# Altium schematic sheet 02-CPU_BOARD.SchDoc
size B
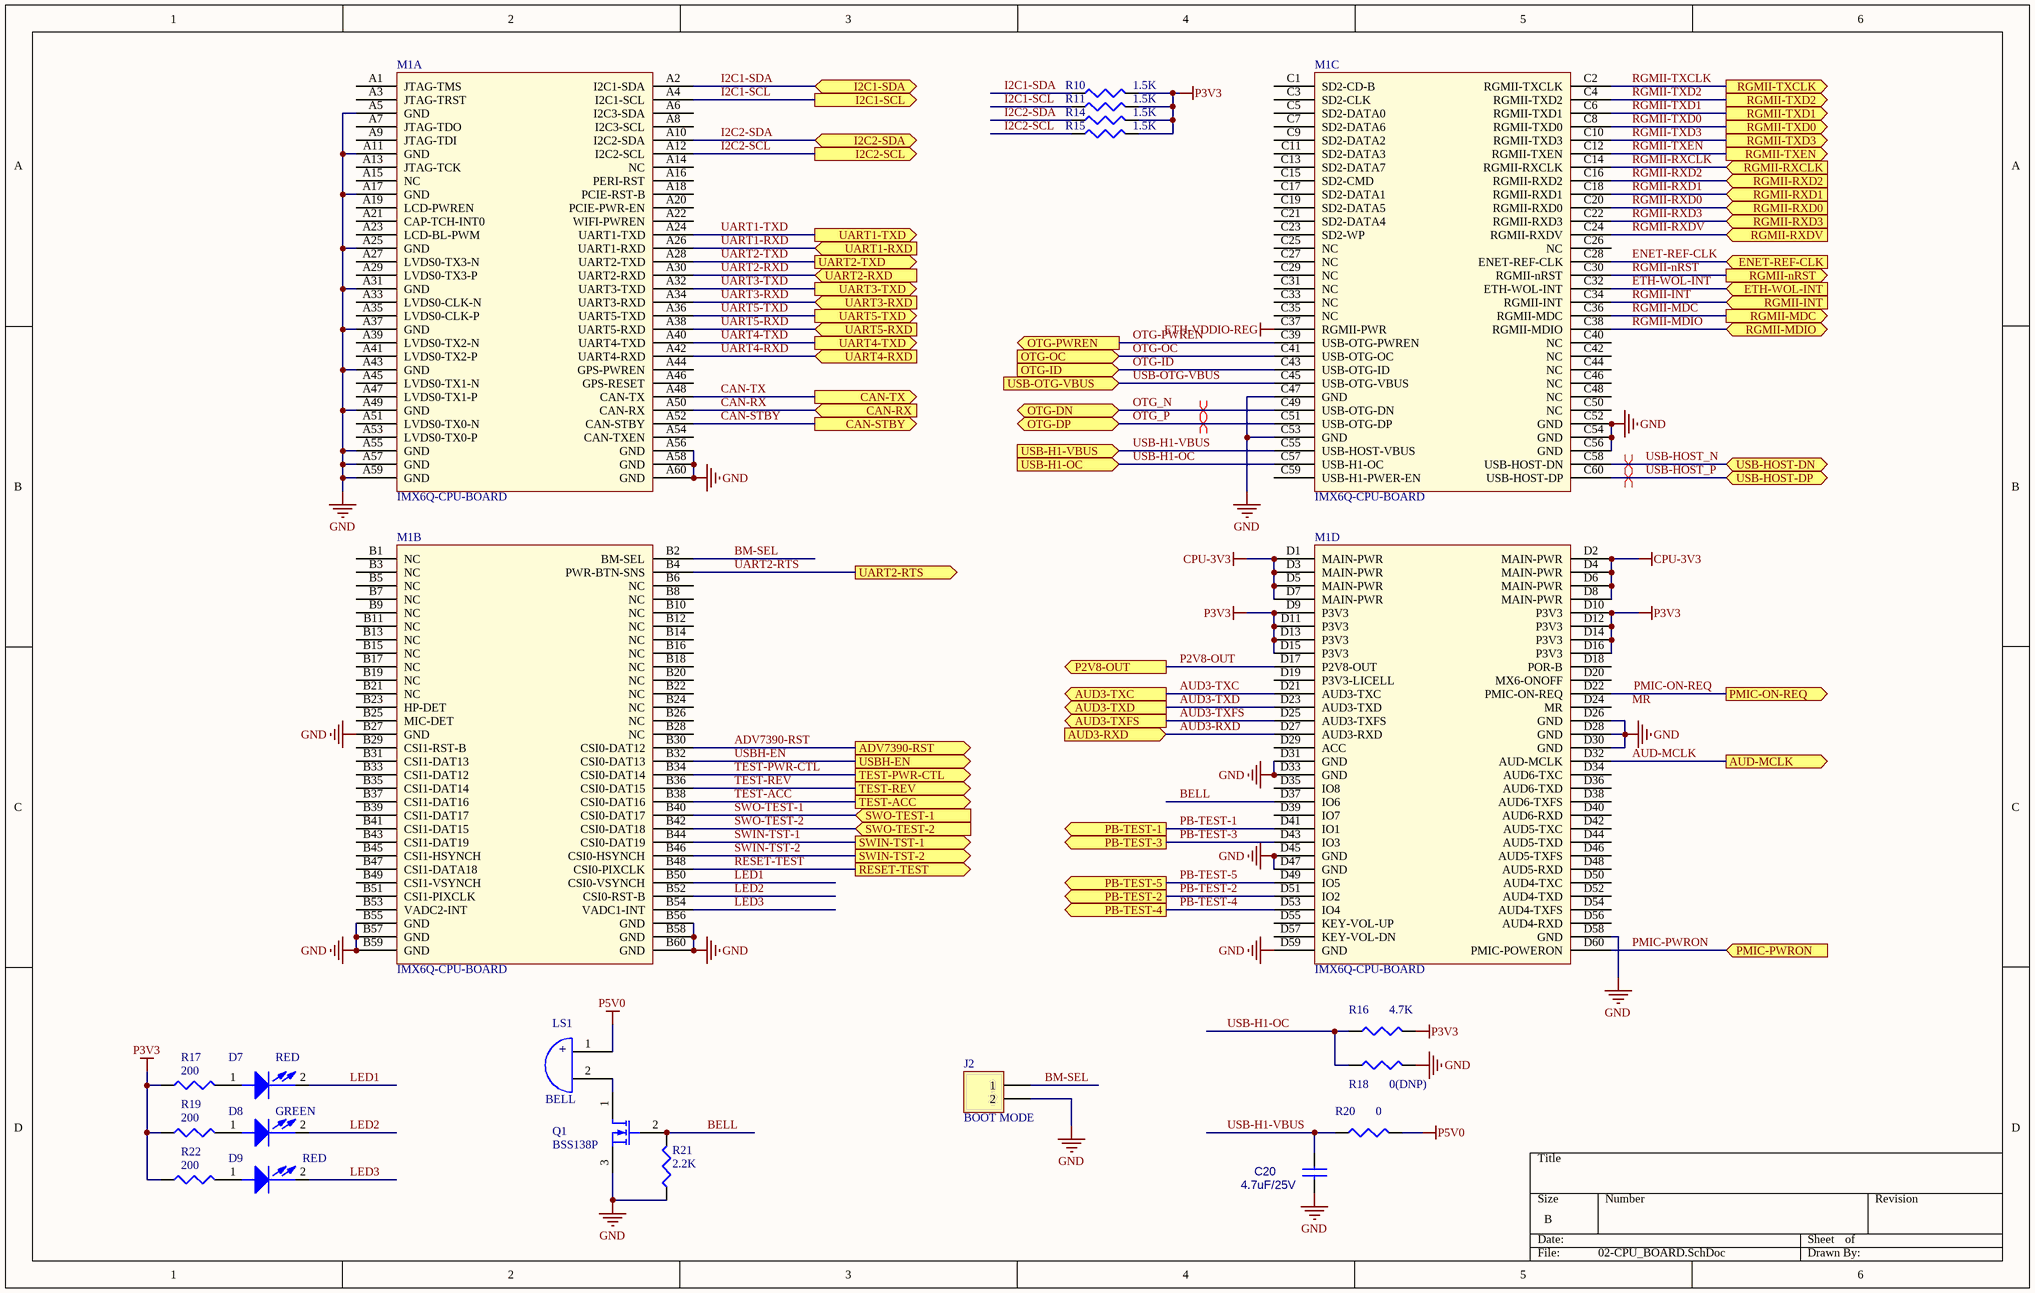
[diagram p0: 02-CPU_BOARD.SchDoc]

## Parts
C20  4.7uF/25V  [0805]
D7  RED  [LED-3MM]
D8  GREEN  [LED-3MM]
D9  RED  [LED-3MM]
J2  BOOT MODE  [HDR1X2]
LS1  BELL  [bell]
M1  IMX6Q-CPU-BOARD  [IMX6-CPU-BOARD]  (parts A,B,C,D of 4)
Q1  BSS138P  [NPN]
R10  1.5K  [0402]
R11  1.5K  [0402]
R14  1.5K  [0402]
R15  1.5K  [0402]
R16  4.7K  [0402]
R17  200  [0402]
R18  0(DNP)  [0402]
R19  200  [0402]
R20  0  [0402]
R21  2.2K  [0402]
R22  200  [0402]

## Ports
ADV7390-RST (out), AUD3-RXD (in), AUD3-TXC (out), AUD3-TXD (out), AUD3-TXFS (out), AUD-MCLK (out), CAN-RX (in), CAN-STBY (out), CAN-TX (out), ENET-REF-CLK (in), ETH-WOL-INT (in), I2C1-SCL (out), I2C1-SDA (bidir), I2C2-SCL (out), I2C2-SDA (bidir), OTG-DN, OTG-DP (bidir), OTG-ID (in), OTG-OC (in), OTG-PWREN (out), P2V8-OUT (out), PB-TEST-1 (out), PB-TEST-2 (out), PB-TEST-3 (out), PB-TEST-4 (out), PB-TEST-5 (out), PMIC-ON-REQ (out), PMIC-PWRON (in), RESET-TEST (out), RGMII-INT (in), RGMII-MDC (out), RGMII-MDIO (bidir), RGMII-nRST (out), RGMII-RXCLK (in), RGMII-RXD0 (in), RGMII-RXD1 (in), RGMII-RXD2 (in), RGMII-RXD3 (in), RGMII-RXDV (in), RGMII-TXCLK (out), RGMII-TXD0 (out), RGMII-TXD1 (out), RGMII-TXD2 (out), RGMII-TXD3 (out), RGMII-TXEN (out), SWIN-TST-1 (out), SWIN-TST-2 (out), SWO-TEST-1 (in), SWO-TEST-2 (in), TEST-ACC (out), TEST-PWR-CTL (out), TEST-REV (out), UART1-RXD (in), UART1-TXD (out), UART2-RTS (out), UART2-RXD (in), UART2-TXD (out), UART3-RXD (in), UART3-TXD (out), UART4-RXD (in), UART4-TXD (out), UART5-RXD (in), UART5-TXD (out), USB-H1-OC (in), USB-H1-VBUS (in), USB-HOST-DN (bidir), USB-HOST-DP (bidir), USB-OTG-VBUS (in), USBH-EN (out)

## Nets
CPU-3V3: M1.D1(MAIN-PWR) M1.D2(MAIN-PWR) M1.D3(MAIN-PWR) M1.D4(MAIN-PWR) M1.D5(MAIN-PWR) M1.D6(MAIN-PWR) M1.D7(MAIN-PWR) M1.D8(MAIN-PWR)
ETH-VDDIO-REG: M1.C37(RGMII-PWR)
GND: C20.2 J2.2 M1.A5(GND) M1.A11(GND) M1.A17(GND) M1.A25(GND) M1.A31(GND) M1.A37(GND) M1.A43(GND) M1.A49(GND) M1.A55(GND) M1.A56(GND) M1.A57(GND) M1.A58(GND) M1.A59(GND) M1.A60(GND) M1.B27(GND) M1.B55(GND) M1.B56(GND) M1.B57(GND) M1.B58(GND) M1.B59(GND) M1.B60(GND) M1.C47(GND) M1.C52(GND) M1.C53(GND) M1.C54(GND) M1.C56(GND) M1.D26(GND) M1.D28(GND) M1.D30(GND) M1.D31(GND) M1.D33(GND) M1.D45(GND) M1.D47(GND) M1.D58(GND) M1.D59(GND) Q1.3(S) R18.2 R21.2
P3V3: M1.D9(P3V3) M1.D10(P3V3) M1.D11(P3V3) M1.D12(P3V3) M1.D13(P3V3) M1.D14(P3V3) M1.D15(P3V3) M1.D16(P3V3) R10.2 R11.2 R14.2 R15.2 R16.2 R17.1 R19.1 R22.1
P5V0: LS1.1 R20.2
ADV7390-RST: M1.B30(CSI0-DAT12) ; port ADV7390-RST
AUD3-RXD: M1.D27(AUD3-RXD) ; port AUD3-RXD
AUD3-TXC: M1.D21(AUD3-TXC) ; port AUD3-TXC
AUD3-TXD: M1.D23(AUD3-TXD) ; port AUD3-TXD
AUD3-TXFS: M1.D25(AUD3-TXFS) ; port AUD3-TXFS
AUD-MCLK: M1.D32(AUD-MCLK) ; port AUD-MCLK
BELL: M1.D37(IO6) Q1.2(G) R21.1
BM-SEL: J2.1 M1.B2(BM-SEL)
CAN-RX: M1.A50(CAN-RX) ; port CAN-RX
CAN-STBY: M1.A52(CAN-STBY) ; port CAN-STBY
CAN-TX: M1.A48(CAN-TX) ; port CAN-TX
ENET-REF-CLK: M1.C28(ENET-REF-CLK) ; port ENET-REF-CLK
ETH-WOL-INT: M1.C32(ETH-WOL-INT) ; port ETH-WOL-INT
I2C1-SCL: M1.A4(I2C1-SCL) R11.1 ; port I2C1-SCL
I2C1-SDA: M1.A2(I2C1-SDA) R10.1 ; port I2C1-SDA
I2C2-SCL: M1.A12(I2C2-SCL) R15.1 ; port I2C2-SCL
I2C2-SDA: M1.A10(I2C2-SDA) R14.1 ; port I2C2-SDA
LED1: D7.2(CATHODE) M1.B50(CSI0-VSYNCH)
LED2: D8.2(CATHODE) M1.B52(CSI0-RST-B)
LED3: D9.2(CATHODE) M1.B54(VADC1-INT)
OTG-ID: M1.C43(USB-OTG-ID) ; port OTG-ID
OTG-OC: M1.C41(USB-OTG-OC) ; port OTG-OC
OTG-PWREN: M1.C39(USB-OTG-PWREN) ; port OTG-PWREN
OTG_N: M1.C49(USB-OTG-DN) ; port OTG-DN
OTG_P: M1.C51(USB-OTG-DP) ; port OTG-DP
P2V8-OUT: M1.D17(P2V8-OUT) ; port P2V8-OUT
PB-TEST-1: M1.D41(IO1) ; port PB-TEST-1
PB-TEST-2: M1.D51(IO2) ; port PB-TEST-2
PB-TEST-3: M1.D43(IO3) ; port PB-TEST-3
PB-TEST-4: M1.D53(IO4) ; port PB-TEST-4
PB-TEST-5: M1.D49(IO5) ; port PB-TEST-5
PMIC-ON-REQ: M1.D22(PMIC-ON-REQ) ; port PMIC-ON-REQ
PMIC-PWRON: M1.D60(PMIC-POWERON) ; port PMIC-PWRON
RESET-TEST: M1.B48(CSI0-PIXCLK) ; port RESET-TEST
RGMII-INT: M1.C34(RGMII-INT) ; port RGMII-INT
RGMII-MDC: M1.C36(RGMII-MDC) ; port RGMII-MDC
RGMII-MDIO: M1.C38(RGMII-MDIO) ; port RGMII-MDIO
RGMII-nRST: M1.C30(RGMII-nRST) ; port RGMII-nRST
RGMII-RXCLK: M1.C14(RGMII-RXCLK) ; port RGMII-RXCLK
RGMII-RXD0: M1.C20(RGMII-RXD0) ; port RGMII-RXD0
RGMII-RXD1: M1.C18(RGMII-RXD1) ; port RGMII-RXD1
RGMII-RXD2: M1.C16(RGMII-RXD2) ; port RGMII-RXD2
RGMII-RXD3: M1.C22(RGMII-RXD3) ; port RGMII-RXD3
RGMII-RXDV: M1.C24(RGMII-RXDV) ; port RGMII-RXDV
RGMII-TXCLK: M1.C2(RGMII-TXCLK) ; port RGMII-TXCLK
RGMII-TXD0: M1.C8(RGMII-TXD0) ; port RGMII-TXD0
RGMII-TXD1: M1.C6(RGMII-TXD1) ; port RGMII-TXD1
RGMII-TXD2: M1.C4(RGMII-TXD2) ; port RGMII-TXD2
RGMII-TXD3: M1.C10(RGMII-TXD3) ; port RGMII-TXD3
RGMII-TXEN: M1.C12(RGMII-TXEN) ; port RGMII-TXEN
SWIN-TST-1: M1.B44(CSI0-DAT19) ; port SWIN-TST-1
SWIN-TST-2: M1.B46(CSI0-HSYNCH) ; port SWIN-TST-2
SWO-TEST-1: M1.B40(CSI0-DAT17) ; port SWO-TEST-1
SWO-TEST-2: M1.B42(CSI0-DAT18) ; port SWO-TEST-2
TEST-ACC: M1.B38(CSI0-DAT16) ; port TEST-ACC
TEST-PWR-CTL: M1.B34(CSI0-DAT14) ; port TEST-PWR-CTL
TEST-REV: M1.B36(CSI0-DAT15) ; port TEST-REV
UART1-RXD: M1.A26(UART1-RXD) ; port UART1-RXD
UART1-TXD: M1.A24(UART1-TXD) ; port UART1-TXD
UART2-RTS: M1.B4(PWR-BTN-SNS) ; port UART2-RTS
UART2-RXD: M1.A30(UART2-RXD) ; port UART2-RXD
UART2-TXD: M1.A28(UART2-TXD) ; port UART2-TXD
UART3-RXD: M1.A34(UART3-RXD) ; port UART3-RXD
UART3-TXD: M1.A32(UART3-TXD) ; port UART3-TXD
UART4-RXD: M1.A42(UART4-RXD) ; port UART4-RXD
UART4-TXD: M1.A40(UART4-TXD) ; port UART4-TXD
UART5-RXD: M1.A38(UART5-RXD) ; port UART5-RXD
UART5-TXD: M1.A36(UART5-TXD) ; port UART5-TXD
USB-H1-OC: M1.C57(USB-H1-OC) R16.1 R18.1 ; port USB-H1-OC
USB-H1-VBUS: C20.1 M1.C55(USB-HOST-VBUS) R20.1 ; port USB-H1-VBUS
USB-HOST_N: M1.C58(USB-HOST-DN) ; port USB-HOST-DN
USB-HOST_P: M1.C60(USB-HOST-DP) ; port USB-HOST-DP
USB-OTG-VBUS: M1.C45(USB-OTG-VBUS) ; port USB-OTG-VBUS
USBH-EN: M1.B32(CSI0-DAT13) ; port USBH-EN
NetD7_1: D7.1(ANODE) R17.2
NetD8_1: D8.1(ANODE) R19.2
NetD9_1: D9.1(ANODE) R22.2
NetLS1_2: LS1.2 Q1.1(D)

Not connected (* = marked no-connect by the designer): M1 A1(JTAG-TMS) A3(JTAG-TRST) A6(I2C3-SDA) A7(JTAG-TDO) A8(I2C3-SCL) A9(JTAG-TDI) A13(JTAG-TCK) A14(NC) A15(NC) A16(PERI-RST) A18(PCIE-RST-B) A19(LCD-PWREN) A20(PCIE-PWR-EN) A21(CAP-TCH-INT0) A22(WIFI-PWREN) A23(LCD-BL-PWM) A27(LVDS0-TX3-N) A29(LVDS0-TX3-P) A33(LVDS0-CLK-N) A35(LVDS0-CLK-P) A39(LVDS0-TX2-N) A41(LVDS0-TX2-P) A44(GPS-PWREN) A45(LVDS0-TX1-N) A46(GPS-RESET) A47(LVDS0-TX1-P) A51(LVDS0-TX0-N) A53(LVDS0-TX0-P) A54(CAN-TXEN) B1(NC) B3(NC) B5(NC) B6(NC) B7(NC) B8(NC) B9(NC) B10(NC) B11(NC) B12(NC) B13(NC) B14(NC) B15(NC) B16(NC) B17(NC) B18(NC) B19(NC) B20(NC) B21(NC) B22(NC) B23(HP-DET) B24(NC) B25(MIC-DET) B26(NC) B28(NC) B29(CSI1-RST-B) B31(CSI1-DAT13) B33(CSI1-DAT12) B35(CSI1-DAT14) B37(CSI1-DAT16) B39(CSI1-DAT17) B41(CSI1-DAT15) B43(CSI1-DAT19) B45(CSI1-HSYNCH) B47(CSI1-DATA18) B49(CSI1-VSYNCH) B51(CSI1-PIXCLK) B53(VADC2-INT) C1(SD2-CD-B) C3(SD2-CLK) C5(SD2-DATA0) C7(SD2-DATA6) C9(SD2-DATA2) C11(SD2-DATA3) C13(SD2-DATA7) C15(SD2-CMD) C17(SD2-DATA1) C19(SD2-DATA5) C21(SD2-DATA4) C23(SD2-WP) C25(NC) C26(NC) C27(NC) C29(NC) C31(NC) C33(NC) C35(NC) C40(NC) C42(NC) C44(NC) C46(NC) C48(NC) C50(NC) C59(USB-H1-PWER-EN) D18(POR-B) D19(P3V3-LICELL) D20(MX6-ONOFF) D24(MR) D29(ACC) D34(AUD6-TXC) D35(IO8) D36(AUD6-TXD) D38(AUD6-TXFS) D39(IO7) D40(AUD6-RXD) D42(AUD5-TXC) D44(AUD5-TXD) D46(AUD5-TXFS) D48(AUD5-RXD) D50(AUD4-TXC) D52(AUD4-TXD) D54(AUD4-TXFS) D55(KEY-VOL-UP) D56(AUD4-RXD) D57(KEY-VOL-DN)

## Layout directives
differential pair: OTG_N, OTG_P, USB-HOST_N, USB-HOST_P

## Notes on the sheet
- Labels drawn without touching a wire or pin: MR
- (in symbol BELL) +

## Library data of the parts
C20 = CAP_Dup1
D7-D9 = LN01401_1
J2 = Header 2: Header, 2-Pin; LatestRevisionDate: 17-Jul-2002; LatestRevisionNote: Re-released for DXP Platform.; Publisher: Altium Limited
Q1 = MOSFET-N: N-Channel MOSFET; Published: 8-Jun-2000; LatestRevisionDate: 17-Jul-2002; LatestRevisionNote: Re-released for DXP Platform.; PackageVersion: 1995/1996; PackageReference: E3; Publisher: Altium Limited; PackageDescription: TO, Flat Index; 3 In-Line, Axial Leads; Body Dia. 4.6mm; Lead Dia. 0.5 mm (max)
R10 R11 R14-R16 R18 R20 = CR16-1003FM
R17 R19 R22 = Res3: Resistor; Value: 1K; Published: 8-Jun-2000; LatestRevisionDate: 29-May-2009; LatestRevisionNote: IPC-7351 Footprint Added.; PackageReference: J1-0603; Publisher: Altium Limited; PackageDescription: Chip Resistor
R21 = Res3: Resistor; Value: 0.1/1W; Published: 8-Jun-2000; LatestRevisionDate: 29-May-2009; LatestRevisionNote: IPC-7351 Footprint Added.; PackageReference: J1-0603; Publisher: Altium Limited; PackageDescription: Chip Resistor